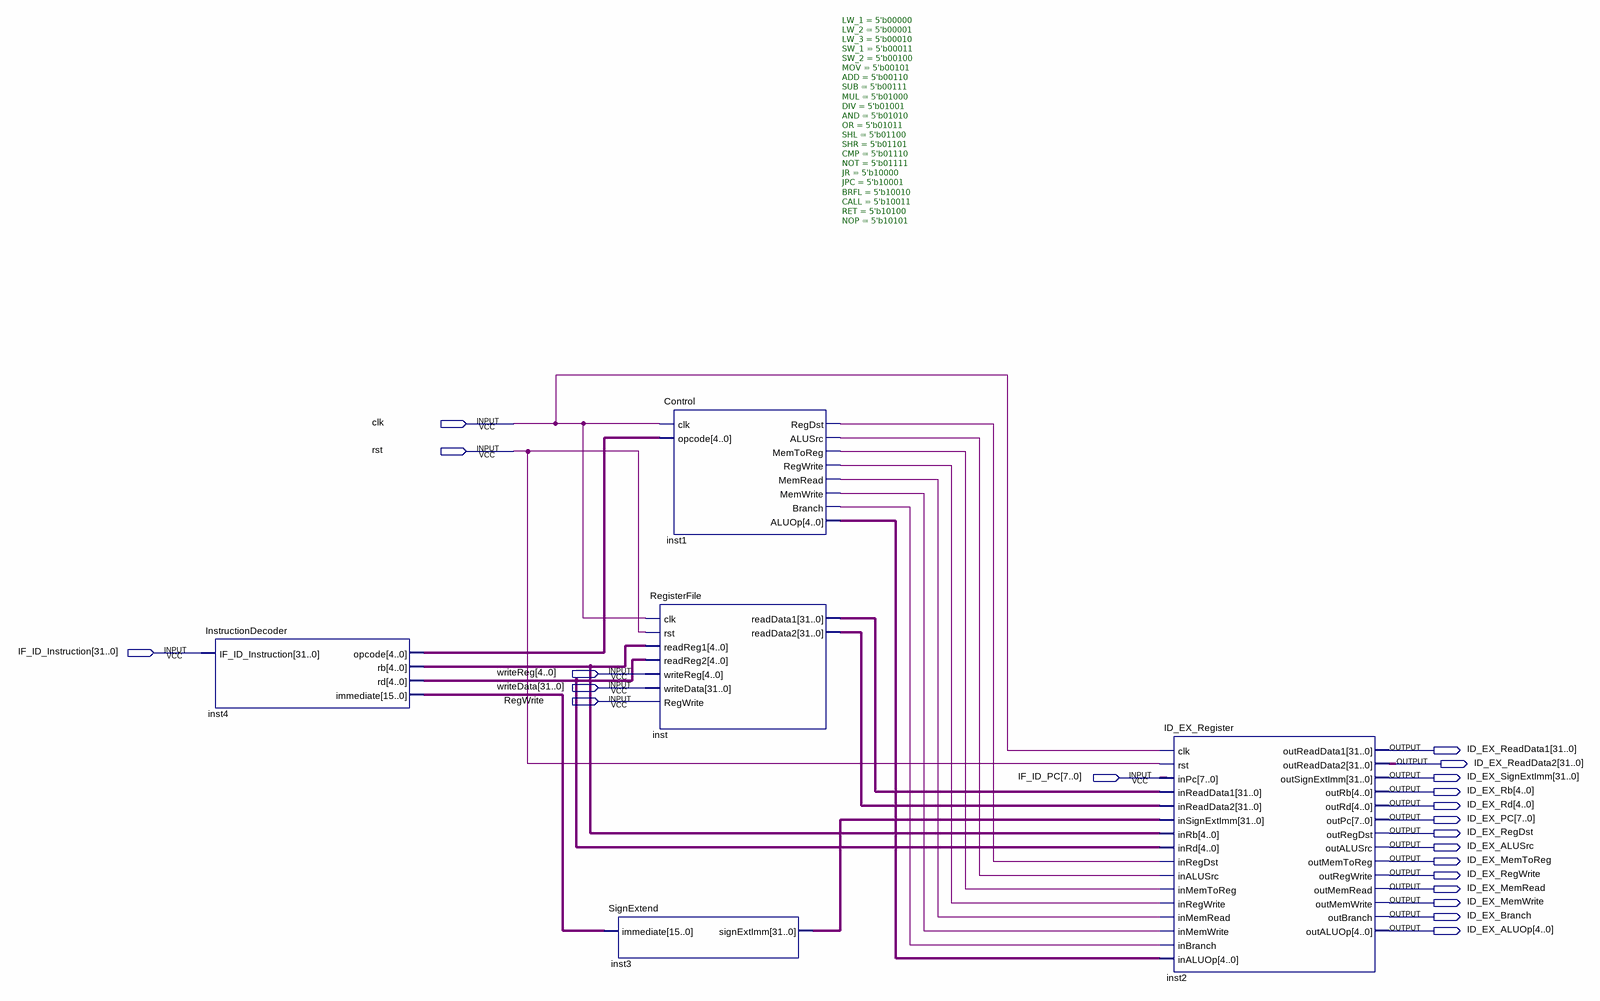
[diagram p0: schematic sheet]
// Quartus schematic ID_STAGE.bdf as structural Verilog: 5 symbols, 21 pins
module ID_STAGE (
  input  clk,
  input  rst,
  input  [31:0] IF_ID_Instruction,
  input  [4:0] writeReg,
  input  [31:0] writeData,
  input  RegWrite,
  input  [7:0] IF_ID_PC,
  output [31:0] ID_EX_ReadData1,
  output [31:0] ID_EX_ReadData2,
  output [31:0] ID_EX_SignExtImm,
  output [4:0] ID_EX_Rb,
  output [4:0] ID_EX_Rd,
  output [7:0] ID_EX_PC,
  output ID_EX_RegDst,
  output ID_EX_ALUSrc,
  output ID_EX_MemToReg,
  output ID_EX_RegWrite,
  output ID_EX_MemRead,
  output ID_EX_MemWrite,
  output ID_EX_Branch,
  output [4:0] ID_EX_ALUOp
);

  wire inst1_alusrc, inst1_branch, inst1_memread, inst1_memtoreg, inst1_memwrite, inst1_regdst,
       inst1_regwrite;
  wire [4:0] inst1_aluop, inst4_opcode, inst4_rb, inst4_rd;
  wire [15:0] inst4_immediate;
  wire [31:0] inst3_signextimm, inst_readdata1, inst_readdata2;

  InstructionDecoder inst4 (
    .IF_ID_Instruction(IF_ID_Instruction), .opcode(inst4_opcode), .rb(inst4_rb), .rd(inst4_rd),
    .immediate(inst4_immediate));
  SignExtend inst3 (.immediate(inst4_immediate), .signExtImm(inst3_signextimm));
  Control #(.LW_1(5'b00000), .LW_2(5'b00001), .LW_3(5'b00010), .SW_1(5'b00011), .SW_2(5'b00100), .MOV(5'b00101), .ADD(5'b00110), .SUB(5'b00111), .MUL(5'b01000), .DIV(5'b01001), .AND(5'b01010), .OR(5'b01011), .SHL(5'b01100), .SHR(5'b01101), .CMP(5'b01110), .NOT(5'b01111), .JR(5'b10000), .JPC(5'b10001), .BRFL(5'b10010), .CALL(5'b10011), .RET(5'b10100), .NOP(5'b10101)) inst1 (
    .clk(clk), .opcode(inst4_opcode), .RegDst(inst1_regdst), .ALUSrc(inst1_alusrc),
    .MemToReg(inst1_memtoreg), .RegWrite(inst1_regwrite), .MemRead(inst1_memread), .MemWrite(inst1_memwrite),
    .Branch(inst1_branch), .ALUOp(inst1_aluop));
  RegisterFile inst (
    .clk(clk), .rst(rst), .readReg1(inst4_rb), .readReg2(inst4_rd), .writeReg(writeReg),
    .writeData(writeData), .RegWrite(RegWrite), .readData1(inst_readdata1), .readData2(inst_readdata2));
  ID_EX_Register inst2 (
    .clk(clk), .rst(rst), .inPc(IF_ID_PC), .inReadData1(inst_readdata1), .inReadData2(inst_readdata2),
    .inSignExtImm(inst3_signextimm), .inRb(inst4_rb), .inRd(inst4_rd), .inRegDst(inst1_regdst),
    .inALUSrc(inst1_alusrc), .inMemToReg(inst1_memtoreg), .inRegWrite(inst1_regwrite),
    .inMemRead(inst1_memread), .inMemWrite(inst1_memwrite), .inBranch(inst1_branch), .inALUOp(inst1_aluop),
    .outReadData1(ID_EX_ReadData1), .outReadData2(ID_EX_ReadData2), .outSignExtImm(ID_EX_SignExtImm),
    .outRb(ID_EX_Rb), .outRd(ID_EX_Rd), .outPc(ID_EX_PC), .outRegDst(ID_EX_RegDst), .outALUSrc(ID_EX_ALUSrc),
    .outMemToReg(ID_EX_MemToReg), .outRegWrite(ID_EX_RegWrite), .outMemRead(ID_EX_MemRead),
    .outMemWrite(ID_EX_MemWrite), .outBranch(ID_EX_Branch), .outALUOp(ID_EX_ALUOp));
endmodule
